# Altium schematic sheet BACKUP_POWER.SchDoc
size 292 x 254 mm
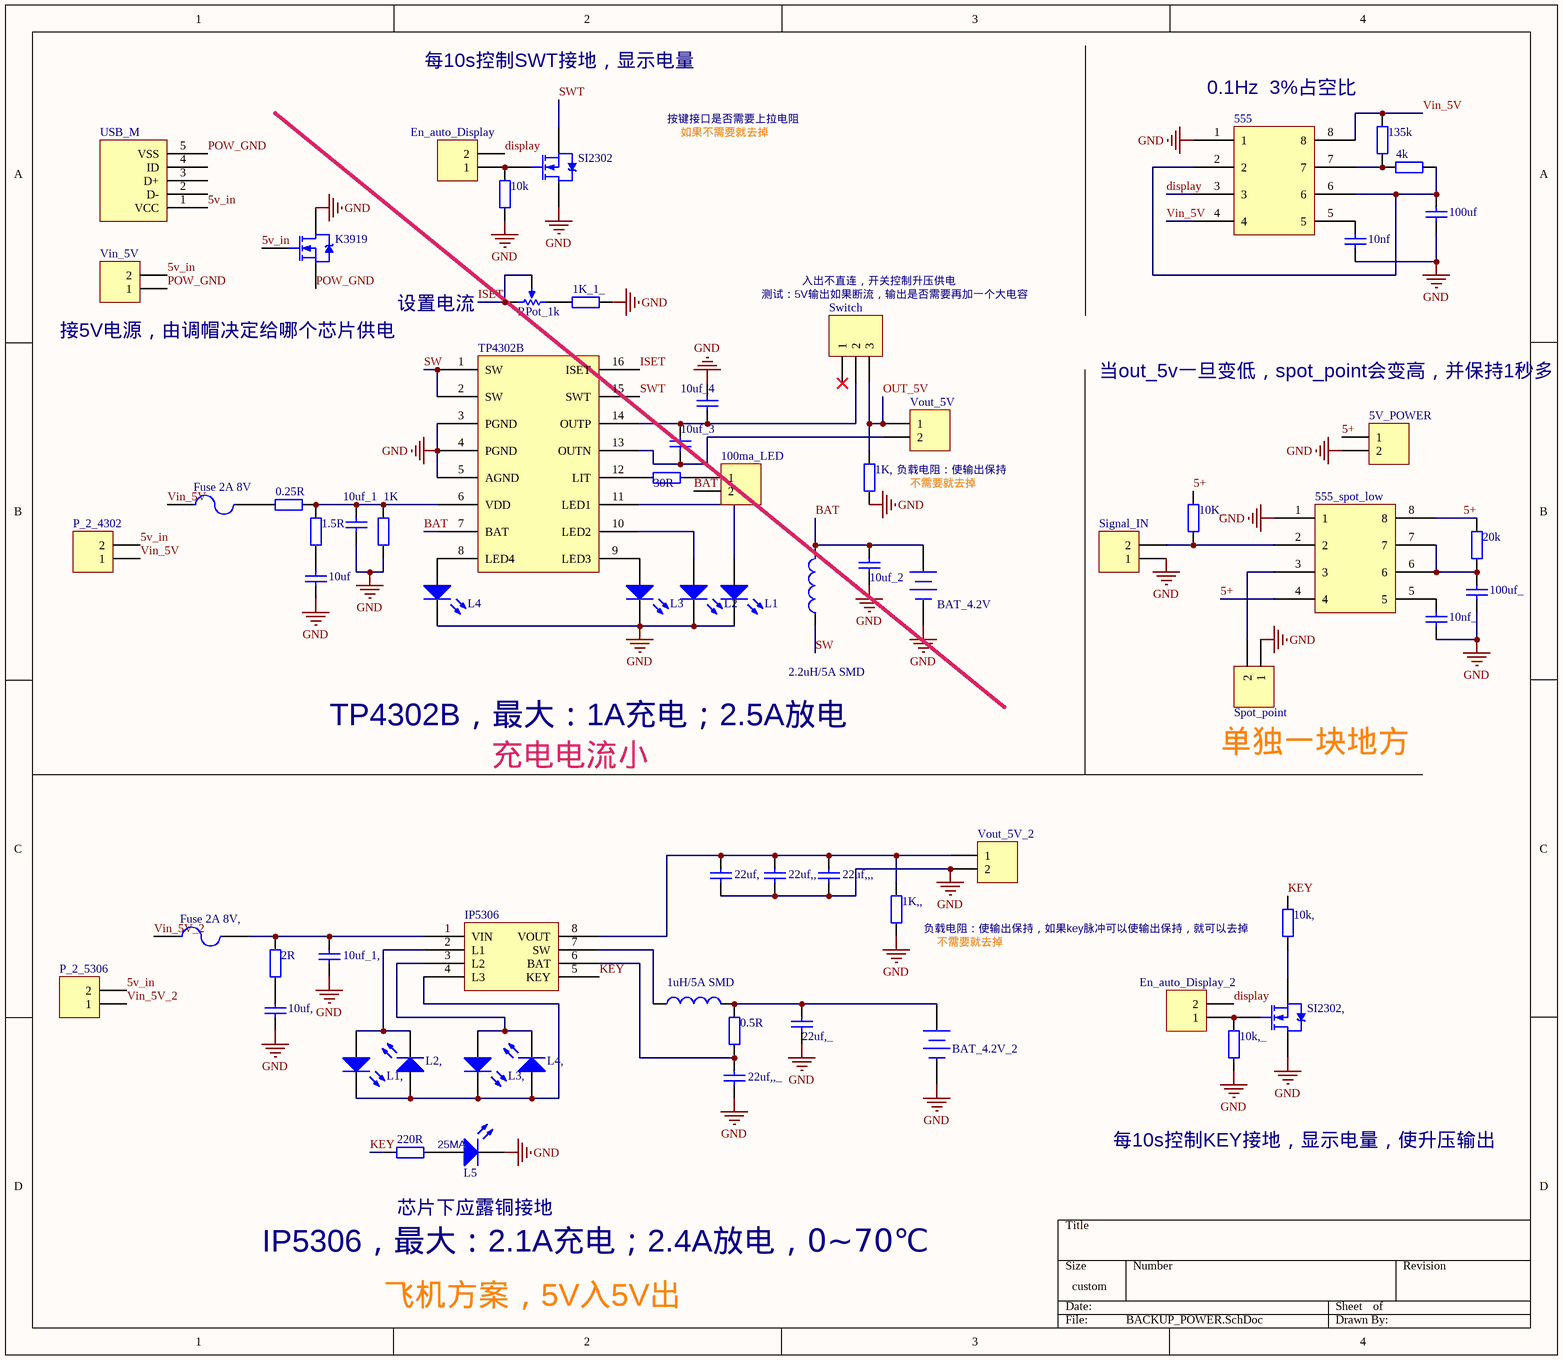
[diagram p0: BACKUP_POWER.SchDoc]

## Parts
0.5R  Res2  [0805A]  (value not drawn)
0.25R  Res2  [1206]  (value not drawn)
1.5R  Res2  [0805A]  (value not drawn)
1K  Res2  [0805A]  (value not drawn)
1K,  Res2  [0805A]  (value not drawn)
1K,,  Res2  [0805A]  (value not drawn)
1K_1_  Res2  [0805A]  (value not drawn)
1uH/5A_SMD  Inductor  [6 X 6-L]  (value not drawn)
2.2uH/5A_SMD  Inductor  [6 X 6-L]  (value not drawn)
2R  Res2  [0805A]  (value not drawn)
4k  Res2  [0805A]  (value not drawn)
5V_POWER  Header 2  [HDR1X2]  (value not drawn)
10k  Res2  [0805A]  (value not drawn)
10k,  Res2  [0805A]  (value not drawn)
10k,_  Res2  [0805A]  (value not drawn)
10K_  Res2  [0805A]  (value not drawn)
10nf  Cap  [C-RAD-0805]  (value not drawn)
10nf_  Cap  [C-RAD-0805]  (value not drawn)
10uf  Cap  [C-RAD-0805]  (value not drawn)
10uf,  Cap  [C-RAD-0805]  (value not drawn)
10uf_1  Cap  [C-RAD-0805]  (value not drawn)
10uf_1,  Cap  [C-RAD-0805]  (value not drawn)
10uf_2  Cap  [C-RAD-0805]  (value not drawn)
10uf_3  Cap  [C-RAD-0805]  (value not drawn)
10uf_4  Cap  [C-RAD-0805]  (value not drawn)
20k  Res2  [0805A]  (value not drawn)
22uf,  Cap  [C-RAD-0805]  (value not drawn)
22uf,,  Cap  [C-RAD-0805]  (value not drawn)
22uf,,,  Cap  [C-RAD-0805]  (value not drawn)
22uf,,_  Cap  [C-RAD-0805]  (value not drawn)
22uf,_  Cap  [C-RAD-0805]  (value not drawn)
30R  Res2  [0805A]  (value not drawn)
100ma_LED  Header 2  [HDR1X2]  (value not drawn)
100uf  Cap  [C-RAD-0805]  (value not drawn)
100uf_  Cap  [C-RAD-0805]  (value not drawn)
135k  Res2  [0805A]  (value not drawn)
220R  Res2  [0805A]  (value not drawn)
555  (no value)  [SOP8]
555_spot_low  (no value)  [SOP8]
BAT_4.2V  B  [HDR1X2]  (value not drawn)
BAT_4.2V_2  B  [HDR1X2]  (value not drawn)
En_auto_Display  Header 2  [HDR1X2]  (value not drawn)
En_auto_Display_2  Header 2  [HDR1X2]  (value not drawn)
Fuse_2A_8V  Fuse 2  [1812F]  (value not drawn)
Fuse_2A_8V,  Fuse 2  [1812F]  (value not drawn)
IP5306  (no value)  [SOP8]
K3919  LR7843  [TO-252]  (value not drawn)
L1  LED0  [LED_0805]  (value not drawn)
L1,  LED0  [LED_0805]  (value not drawn)
L2  LED0  [LED_0805]  (value not drawn)
L2,  LED0  [LED_0805]  (value not drawn)
L3  LED0  [LED_0805]  (value not drawn)
L3,  LED0  [LED_0805]  (value not drawn)
L4  LED0  [LED_0805]  (value not drawn)
L4,  LED0  [LED_0805]  (value not drawn)
L5  LED0  [LED_0805]  (value not drawn)
P_2_4302  Header 2  [HDR1X2]  (value not drawn)
P_2_5306  Header 2  [HDR1X2]  (value not drawn)
RPot_1k  RPot  [VR_A1]  (value not drawn)
SI2302  LR7843  [SOT-23]  (value not drawn)
SI2302,  LR7843  [SOT-23]  (value not drawn)
Signal_IN  Header 2  [HDR1X2]  (value not drawn)
Spot_point  Header 2  [HDR1X2]  (value not drawn)
Switch  Header 3  [SWITCH_A1]  (value not drawn)
TP4302B  (no value)  [SOP16]
USB_M  USB_M  [USB_MICRO]  (value not drawn)
Vin_5V  Header 2  [HDR1X2]  (value not drawn)
Vout_5V  Header 2  [HDR1X2]  (value not drawn)
Vout_5V_2  Header 2  [HDR1X2]  (value not drawn)

## Nets
GND: 1K.1 1K,.1 1K,,.1 1K_1_.1 5V_POWER.2 10k.2 10k,_.2 10nf.1 10nf_.1 10uf.2 10uf,.2 10uf_1.2 10uf_1,.2 10uf_2.2 10uf_4.2 22uf,.2 22uf,,.2 22uf,,,.2 22uf,,_.2 22uf,_.2 100uf.1 100uf_.1 555.1 555_spot_low.1 BAT_4.2V.2(-) BAT_4.2V_2.2(-) K3919.2(D) L1.2(K) L2.2(K) L3.2(K) L4.2(K) L5.2(K) SI2302.2(D) SI2302,.2(D) Signal_IN.1 Spot_point.1 TP4302B.3(PGND) TP4302B.4(PGND) TP4302B.5(AGND) Vout_5V_2.2
5+: 5V_POWER.1 10K_.2 20k.2 555_spot_low.4 555_spot_low.8
5v_in: K3919.1(G) P_2_4302.2 P_2_5306.2 USB_M.1(VCC) Vin_5V.2
BAT: 2.2uH/5A_SMD.2 10uf_2.1 100ma_LED.2 BAT_4.2V.1(+) TP4302B.7(BAT)
display: 555.3 En_auto_Display.2 En_auto_Display_2.2
ISET: RPot_1k.2(TAP) RPot_1k.3(BOT) TP4302B.16(ISET)
KEY: 10k,.1 220R.2 IP5306.5(KEY)
OUT_5V: 1K,.2 Switch.3 Vout_5V.1
POW_GND: K3919.3(S) USB_M.5(VSS) Vin_5V.1
SW: 2.2uH/5A_SMD.1 TP4302B.1(SW) TP4302B.2(SW)
SWT: SI2302.3(S) TP4302B.15(SWT)
Vin_5V: 135k.1 555.4 555.8 Fuse_2A_8V.1 P_2_4302.1
Vin_5V_2: Fuse_2A_8V,.1 P_2_5306.1
Net0.5R_1: 0.5R.1 1uH/5A_SMD.2 22uf,_.1 BAT_4.2V_2.1(+)
Net0.5R_2: 0.5R.2 22uf,,_.1 IP5306.6(BAT)
Net0.25R_1: 0.25R.1 1.5R.2 1K.2 10uf_1.1 TP4302B.6(VDD)
Net0.25R_2: 0.25R.2 Fuse_2A_8V.2
Net1.5R_1: 1.5R.1 10uf.1
Net1K,,_2: 1K,,.2 22uf,.1 22uf,,.1 22uf,,,.1 IP5306.8(VOUT) Vout_5V_2.1
Net1K_1__2: 1K_1_.2 RPot_1k.1(TOP)
Net1uH/5A_SMD_1: 1uH/5A_SMD.1 IP5306.7(SW)
Net2R_1: 2R.1 10uf,.1
Net2R_2: 2R.2 10uf_1,.1 Fuse_2A_8V,.2 IP5306.1(VIN)
Net4k_1: 4k.1 100uf.2 555.2 555.6
Net4k_2: 4k.2 135k.2 555.7
Net10k,_2: 10k,.2 SI2302,.3(S)
Net10k,__1: 10k,_.1 En_auto_Display_2.1 SI2302,.1(G)
Net10k_1: 10k.1 En_auto_Display.1 SI2302.1(G)
Net10K__1: 10K_.1 555_spot_low.2 Signal_IN.2
Net10nf_2: 10nf.2 555.5
Net10nf__2: 10nf_.2 555_spot_low.5
Net10uf_3_1: 10uf_3.1 10uf_4.1 Switch.2 TP4302B.14(OUTP)
Net10uf_3_2: 10uf_3.2 TP4302B.13(OUTN) Vout_5V.2
Net20k_1: 20k.1 100uf_.2 555_spot_low.6 555_spot_low.7
Net30R_1: 30R.1 100ma_LED.1
Net30R_2: 30R.2 TP4302B.12(LIT)
Net220R_1: 220R.1 L5.1(A)
Net555_spot_low_3: 555_spot_low.3 Spot_point.2
NetIP5306_2: IP5306.2(L1) L1,.1(A) L2,.2(K)
NetIP5306_3: IP5306.3(L2) L3,.1(A) L4,.2(K)
NetIP5306_4: IP5306.4(L3) L1,.2(K) L2,.1(A) L3,.2(K) L4,.1(A)
NetL1_1: L1.1(A) TP4302B.11(LED1)
NetL2_1: L2.1(A) TP4302B.10(LED2)
NetL3_1: L3.1(A) TP4302B.9(LED3)
NetL4_1: L4.1(A) TP4302B.8(LED4)

Not connected (* = marked no-connect by the designer): Switch 1*; USB_M 2(D-) 3(D+) 4(ID)

## Notes on the sheet
- 每10s控制SWT接地，显示电量
- 0.1Hz  3%占空比
- 按键接口是否需要上拉电阻
- 如果不需要就去掉
- 测试：5V输出如果断流，输出是否需要再加一个大电容
- 入出不直连，开关控制升压供电
- (near Vin_5V) 接5V电源，由调帽决定给哪个芯片供电
- 设置电流
- 当out_5v一旦变低，spot_point会变高，并保持1秒多
- 负载电阻：使输出保持
- 不需要就去掉
- TP4302B，最大：1A充电；2.5A放电
- 充电电流小
- 单独一块地方
- (near 1K,,) 负载电阻：使输出保持，如果key脉冲可以使输出保持，就可以去掉
- (near 1K,,) 不需要就去掉
- (near L5) 25MA
- 每10s控制KEY接地，显示电量，使升压输出
- 芯片下应露铜接地
- IP5306，最大：2.1A充电；2.4A放电，0~70℃
- 飞机方案，5V入5V出

## Library data of the parts
0.5R 0.25R 1.5R 1K 1K, 1K,, 1K_1_ 2R 4k 10k 10k, 10k,_ 10K_ 20k 30R 135k 220R = Res2: Resistor; Value: 1K; Published: 8-Jun-2000; LatestRevisionDate: 17-Jul-2002; LatestRevisionNote: Re-released for DXP Platform.; PackageReference: AXIAL-0.4; Publisher: Altium Limited; PackageDescription: Axial Device, Thru-Hole; 2 Leads; 0.4 in Pin Spacing
1uH/5A_SMD 2.2uH/5A_SMD = Inductor: Code_IEC: 1005; Published: 8-Jun-2000; LatestRevisionDate: 29-May-2009; LatestRevisionNote: IPC-7351 Footprint Added.; PackageReference: 0402-A; Publisher: Altium Limited; PackageDescription: Chip Inductor; Code_JEITA: 0402
5V_POWER 100ma_LED En_auto_Display En_auto_Display_2 P_2_4302 P_2_5306 Signal_IN Spot_point Vin_5V Vout_5V Vout_5V_2 = Header 2: Header, 2-Pin; LatestRevisionDate: 17-Jul-2002; LatestRevisionNote: Re-released for DXP Platform.; Publisher: Altium Limited
10nf 10nf_ 10uf 10uf, 10uf_1 10uf_1, 10uf_2-10uf_4 22uf, 22uf,, 22uf,,, 22uf,,_ 22uf,_ 100uf 100uf_ = Cap: Capacitor; Value: 0.1uF; Published: 8-Jun-2000; LatestRevisionDate: 17-Jul-2002; LatestRevisionNote: Re-released for DXP Platform.; PackageReference: RAD-0.3; Publisher: Altium Limited; PackageDescription: Radial Cap, Thru-Hole; 2 Leads; 0.3 in Pin Spacing
555 555_spot_low = 555
BAT_4.2V BAT_4.2V_2 = BAT
Fuse_2A_8V Fuse_2A_8V, = Fuse 2: Fuse; Published: 8-Jun-2000; LatestRevisionDate: 17-Jul-2002; LatestRevisionNote: Re-released for DXP Platform.; PackageReference: PIN-W2/E2.8; Publisher: Altium Limited; PackageDescription: Thru-Hole; 2 Leads
IP5306 = IP5306
K3919 SI2302 SI2302, = NMOS-2: N-Channel Power MOSFET; Note: Pin 2 is electrically connected to pin 4.; Published: 8-Jun-2000; LatestRevisionDate: 17-Jul-2002; LatestRevisionNote: Re-released for DXP Platform.; DatasheetDocument: PD-9.814; PackageReference: TO-220AB; Publisher: Altium Limited; Code_JEDEC: TO-220-AB; ComponentLink1Description: Manufacturer Link; ComponentLink1URL: http://www.irf.com/
L1 L1, L2 L2, L3 L3, L4 L4, L5 = LED0: 发光二极管; Published: 8-Jun-2000; LatestRevisionDate: 08-Jul-2005; LatestRevisionNote: Mech Layer 1 removed.; PackageReference: LED-0; Publisher: Altium Limited
RPot_1k = RPot: 精密可调电阻; Sim Note: Enter the Resistance value and the set point into parameter fields.; Set Position: 0.5; Published: 8-Jun-2000; LatestRevisionDate: 17-Jul-2002; LatestRevisionNote: Re-released for DXP Platform.; PackageReference: VR5; Publisher: Altium Limited
Switch = Header 3: Header, 3-Pin; LatestRevisionDate: 17-Jul-2002; LatestRevisionNote: Re-released for DXP Platform.; Publisher: Altium Limited
TP4302B = TP4302
USB_M = USB_M: MicroUSB接口